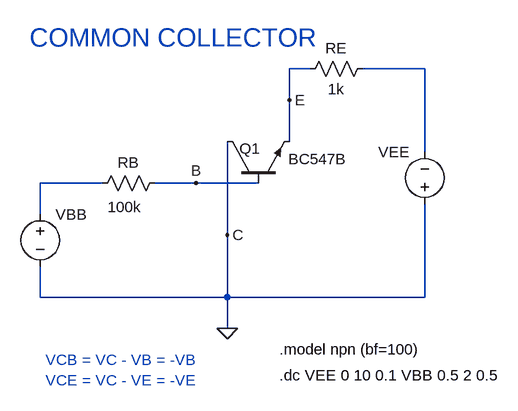
[diagram p0: schematic Common_Collector.asc]
Common_Collector.asc, the LTspice schematic file:
Version 4
SHEET 1 880 680
WIRE 464 -112 432 -112
WIRE 640 -112 544 -112
WIRE 432 -64 432 -112
WIRE 432 0 432 -64
WIRE 640 16 640 -112
WIRE 144 64 48 64
WIRE 288 64 224 64
WIRE 384 64 288 64
WIRE 48 112 48 64
WIRE 336 144 336 0
WIRE 48 240 48 192
WIRE 336 240 336 144
WIRE 336 240 48 240
WIRE 640 240 640 96
WIRE 640 240 336 240
WIRE 336 288 336 240
FLAG 336 288 0
FLAG 432 -64 E
FLAG 288 64 B
FLAG 336 144 C
SYMBOL voltage 48 96 R0
SYMATTR InstName VBB
SYMATTR Value ""
SYMBOL voltage 640 112 R180
WINDOW 0 24 96 Left 2
WINDOW 3 24 16 Left 2
SYMATTR InstName VEE
SYMATTR Value ""
SYMBOL res 240 48 R90
WINDOW 0 0 56 VBottom 2
WINDOW 3 37 62 VTop 2
SYMATTR InstName RB
SYMATTR Value 100k
SYMBOL res 560 -128 R90
WINDOW 0 0 56 VBottom 2
WINDOW 3 32 56 VTop 2
SYMATTR InstName RE
SYMATTR Value 1k
SYMBOL npn 336 64 R270
WINDOW 0 53 19 VRight 2
WINDOW 3 37 94 VRight 2
SYMATTR InstName Q1
SYMATTR Value BC547B
TEXT 416 320 Left 2 !.model npn (bf=100)
TEXT 416 360 Left 2 !.dc VEE 0 10 0.1 VBB 0.5 2 0.5
TEXT 56 336 Left 2 ;VCB = VC - VB = -VB
TEXT 32 -160 Left 4 ;COMMON COLLECTOR
TEXT 56 368 Left 2 ;VCE = VC - VE = -VE

The netlist it stands for:
* Common_Collector.asc
VBB N002 0
VEE 0 N001
RB B N002 100k
RE N001 E 1k
Q1 0 B E 0 BC547B
.model NPN NPN
.model PNP PNP
.lib standard.bjt
.model npn (bf=100)
.dc VEE 0 10 0.1 VBB 0.5 2 0.5
* VCB = VC - VB = -VB
* COMMON COLLECTOR
* VCE = VC - VE = -VE
.backanno
.end